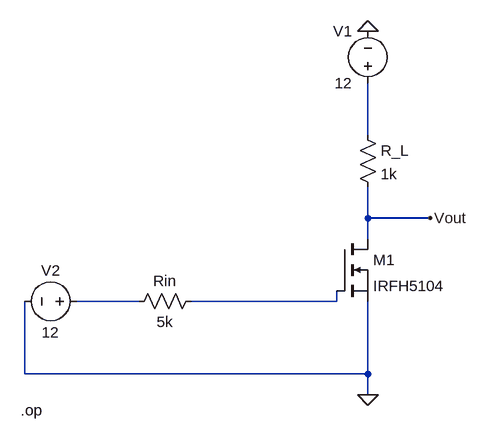
[diagram p0: schematic nmos-draft.asc]
nmos-draft.asc, the LTspice schematic file:
Version 4
SHEET 1 880 680
WIRE 208 32 208 -48
WIRE 208 160 208 112
WIRE 304 160 208 160
WIRE 208 192 208 160
WIRE -144 288 -240 288
WIRE 160 288 160 272
WIRE 160 288 -64 288
WIRE -320 400 -320 288
WIRE 208 400 208 288
WIRE 208 400 -320 400
WIRE 208 432 208 400
FLAG 208 432 0
FLAG 208 -128 0
FLAG 304 160 Vout
SYMBOL nmos 160 192 R0
SYMATTR InstName M1
SYMATTR Value IRFH5104
SYMBOL res 192 16 R0
SYMATTR InstName R_L
SYMATTR Value 1k
SYMBOL res -48 272 R90
WINDOW 0 0 56 VBottom 2
WINDOW 3 32 56 VTop 2
SYMATTR InstName Rin
SYMATTR Value 5k
SYMBOL voltage 208 -32 R180
WINDOW 0 24 96 Left 2
WINDOW 3 24 16 Left 2
WINDOW 123 0 0 Left 0
WINDOW 39 0 0 Left 0
SYMATTR InstName V1
SYMATTR Value 12
SYMBOL voltage -224 288 R90
WINDOW 0 -32 56 VBottom 2
WINDOW 3 32 56 VTop 2
WINDOW 123 0 0 Left 0
WINDOW 39 0 0 Left 0
SYMATTR InstName V2
SYMATTR Value 12
TEXT -326 456 Left 2 !.op

The netlist it stands for:
* nmos-draft.asc
M1 Vout N003 0 0 IRFH5104
R_L N001 Vout 1k
Rin N003 N002 5k
V1 N001 0 12
V2 N002 0 12
.model NMOS NMOS
.model PMOS PMOS
.lib standard.mos
.op
.backanno
.end